# Altium schematic sheet AuxiliaryPowerSupply.SchDoc
size A4; SheetNumber: 13; SheetTotal: 15
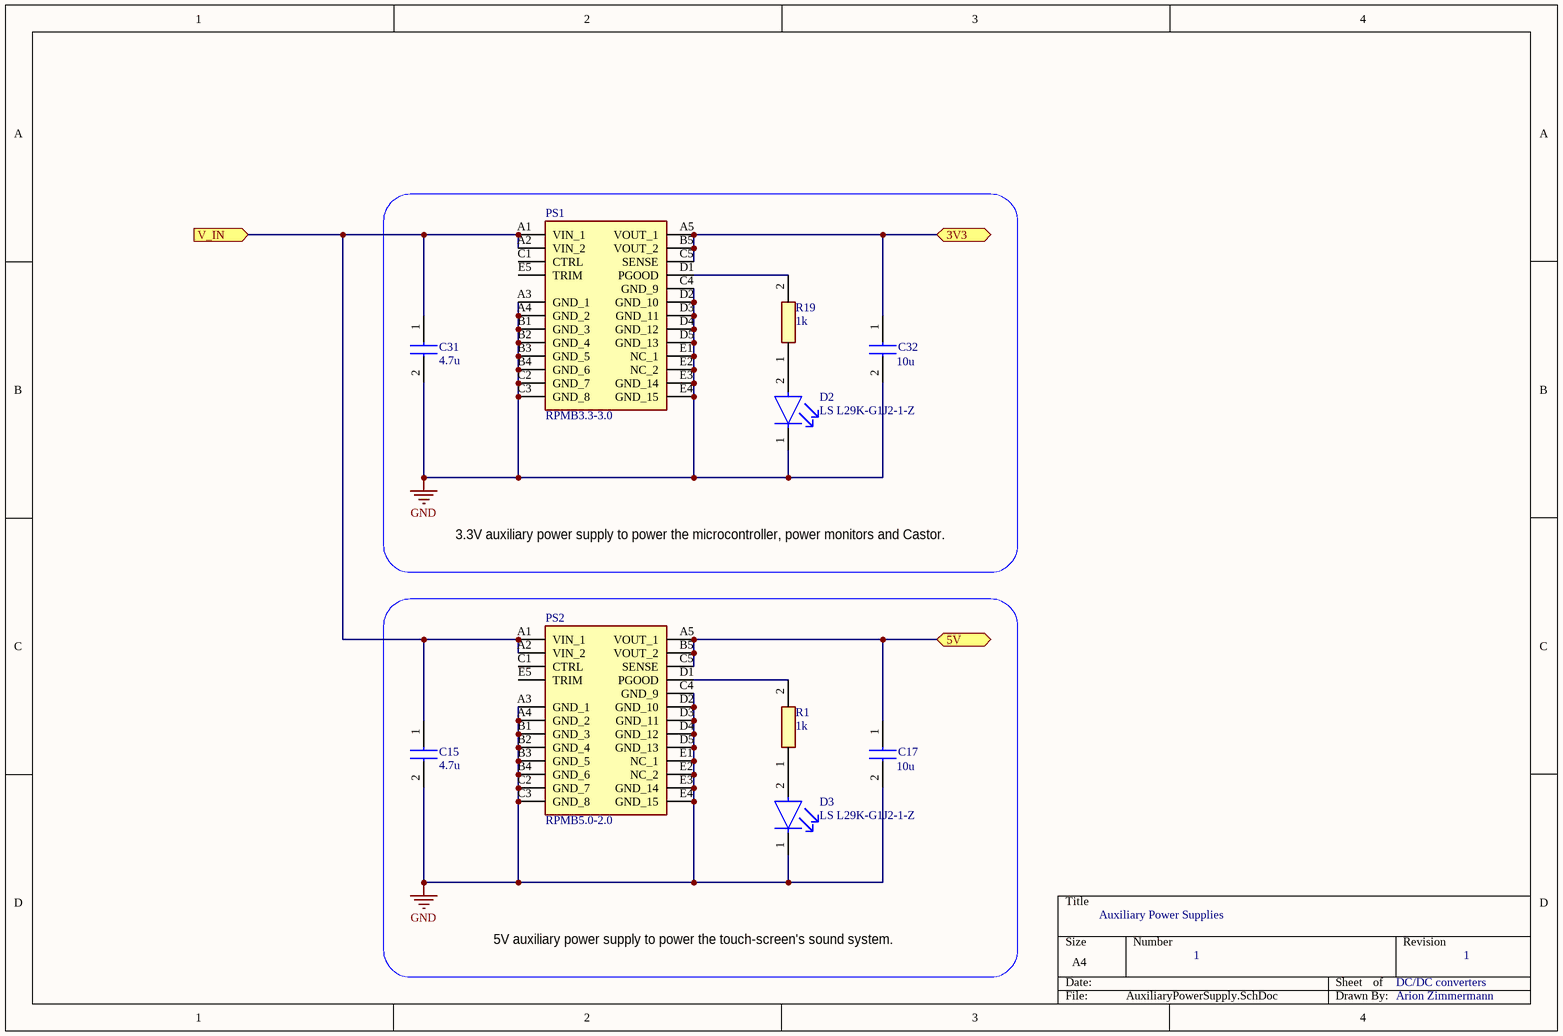
[diagram p0: AuxiliaryPowerSupply.SchDoc]

## Parts
C15  value 4.7u  [CAPC5750X310N]  (hidden comment: C5750JB2A475M230KA)
C17  value 10u  [C1206]  (hidden comment: C1206C106K4RACTU)
C31  value 4.7u  [CAPC5750X310N]  (hidden comment: C5750JB2A475M230KA)
C32  value 10u  [C1206]  (hidden comment: C1206C106K4RACTU)
D2  LS L29K-G1J2-1-Z  [FP-LS_L29K-MFG]
D3  LS L29K-G1J2-1-Z  [FP-LS_L29K-MFG]
PS1  RPMB3.3-3.0  [RPMB5030]
PS2  RPMB5.0-2.0  [RPMB5020]
R1  value 1k  [RESC1608X55N]  (hidden comment: CRCW06031K00JNEAC)
R19  value 1k  [RESC1608X55N]  (hidden comment: CRCW06031K00JNEAC)

## Ports
3V3 (bidir), 5V (bidir), V_IN (in)

## Nets
GND: C15.2 C17.2 C31.2 C32.2 D2.1(C) D3.1(C) PS1.A3(GND_1) PS1.A4(GND_2) PS1.B1(GND_3) PS1.B2(GND_4) PS1.B3(GND_5) PS1.B4(GND_6) PS1.C2(GND_7) PS1.C3(GND_8) PS1.C4(GND_9) PS1.D2(GND_10) PS1.D3(GND_11) PS1.D4(GND_12) PS1.D5(GND_13) PS1.E1(NC_1) PS1.E2(NC_2) PS1.E3(GND_14) PS1.E4(GND_15) PS2.A3(GND_1) PS2.A4(GND_2) PS2.B1(GND_3) PS2.B2(GND_4) PS2.B3(GND_5) PS2.B4(GND_6) PS2.C2(GND_7) PS2.C3(GND_8) PS2.C4(GND_9) PS2.D2(GND_10) PS2.D3(GND_11) PS2.D4(GND_12) PS2.D5(GND_13) PS2.E1(NC_1) PS2.E2(NC_2) PS2.E3(GND_14) PS2.E4(GND_15)
3V3: C32.1 PS1.A5(VOUT_1) PS1.B5(VOUT_2) PS1.C5(SENSE) ; port 3V3
5V: C17.1 PS2.A5(VOUT_1) PS2.B5(VOUT_2) PS2.C5(SENSE) ; port 5V
V_IN: C15.1 C31.1 PS1.A1(VIN_1) PS1.A2(VIN_2) PS2.A1(VIN_1) PS2.A2(VIN_2) ; port V_IN
NetD2_2: D2.2(A) R19.1
NetD3_2: D3.2(A) R1.1
NetPS1_D1: PS1.D1(PGOOD) R19.2
NetPS2_D1: PS2.D1(PGOOD) R1.2

Not connected (* = marked no-connect by the designer): PS1 C1(CTRL) E5(TRIM); PS2 C1(CTRL) E5(TRIM)

## Notes on the sheet
- 3.3V auxiliary power supply to power the microcontroller, power monitors and Castor.
- Auxiliary Power Supplies
- 5V auxiliary power supply to power the touch-screen's sound system.
- 1
- DC/DC converters
- Arion Zimmermann

## Library data of the parts
C15 C31 = C5750X7R2A475K230KA: Capacitor; Manufacturer_Name: TDK; Datasheet Link: https://product.tdk.com/de/search/capacitor/ceramic/mlcc/info?part_no=C5750X7R2A475K230KA; Height: 3.1mm; Manufacturer_Part_Number: C5750X7R2A475K230KA; Mouser Part Number: 810-C5750X7R2A475K; Mouser Price/Stock: https://www.mouser.co.uk/ProductDetail/TDK/C5750X7R2A475K230KA?qs=NRhsANhppD88FUXESCqIJQ%3D%3D; Arrow Part Number: C5750X7R2A475K230KA; Arrow Price/Stock: https://www.arrow.com/en/products/c5750x7r2a475k230ka/tdk; Supplier 1: Mouser; Supplier Part Number 1: 810-C5750JB2A475M23A
C17 C32 = C1206C106K4RACTU: Capacitor; Manufacturer_Name: Kemet; Datasheet Link: https://content.kemet.com/datasheets/KEM_C1002_X7R_SMD.pdf; Manufacturer_Part_Number: C1206C106K4RACTU; Mouser Part Number: 80-C1206C106K4R; Mouser Price/Stock: https://www.mouser.co.uk/ProductDetail/KEMET/C1206C106K4RACTU?qs=guDyKOyRtV0mxqxQedB7kA%3D%3D; Arrow Part Number: C1206C106K4RACTU; Arrow Price/Stock: https://www.arrow.com/en/products/c1206c106k4ractu/kemet-corporation
D2 D3 = CMP-62016-000014-1: LED RED DIFFUSED 0603 SMD; Manufacturer: Osram Opto; Luminous Flux: 0.0081/0.0254lm; Forward Voltage: 1.8V; Luminous Intensity: 1.8-2.24/5.6-7.1mcd; Reverse Voltage: 12V; Peak Emmision Wavelength: 643nm; Max Junction Temp: +110°C; Viewing Angle: 160°; Wavelength: 630nm; Forward Current: 2mA; Led Orientation: Top View; Category: Diode; Temperature Range High: +100°C; Automotive: No; Temperature: -40°C to +100°C; Device Class L3: unset; Mouser Description: LED Uni-Color Red 643nm Automotive 2-Pin SMD T/R; Manufacturer Part Number: LS L29K-G1J2-1-Z; ComponentLink2Description: Datasheet; Lead Free: Yes; Device Class L2: LEDs; ComponentLink2URL: https://dammedia.osram.info/media/resource/hires/osram-dam-5662679/LS%20L29K_EN.pdf; Temperature Range Low: -40°C; RoHS: TRUE; Digikey Description: LED RED DIFFUSED 0603 SMD; Colour: Red; Device Class L1: Optoelectronics; Package: LS_L29K; Octopart: https://octopart.com/ls+l29k-g1j2-1-z-osram+opto-31093939; Height: 0.67mm
PS1 = RPMB5.0-3.0: Power Supply; Manufacturer_Name: RECOM Power; Datasheet Link: https://componentsearchengine.com/Datasheets/1/RPMB5.0-3.0.pdf; Height: 3.75mm; Manufacturer_Part_Number: RPMB5.0-3.0; Mouser Part Number: 919-RPMB5.0-3.0; Mouser Price/Stock: https://www.mouser.co.uk/ProductDetail/RECOM-Power/RPMB50-30?qs=wnTfsH77Xs7FdqATAuFwWQ%3D%3D; Supplier 1: Mouser; Supplier Part Number 1: 919-RPMB3.3-3.0
PS2 = RPMB5.0-2.0: Power Supply; Manufacturer_Name: RECOM Power; Datasheet Link: https://g.recomcdn.com/media/Datasheet/pdf/.f_GMSoRX/.t173c310db6f6fe5108a0/Datasheet-322/RPMB-2_0.pdf; Height: 4mm; Manufacturer_Part_Number: RPMB5.0-2.0
R1 R19 = CRCW06031K00JNEAC: Resistor; Manufacturer_Name: Vishay; Datasheet Link: http://www.vishay.com/docs/28773/crcwce3.pdf; Height: 0.55mm; Manufacturer_Part_Number: CRCW06031K00JNEAC; Mouser Part Number: 71-CRCW06031K00JNEAC; Mouser Price/Stock: https://www.mouser.co.uk/ProductDetail/Vishay-Dale/CRCW06031K00JNEAC?qs=E3Y5ESvWgWPM5t3DlmyFHQ%3D%3D; Arrow Part Number: CRCW06031K00JNEAC; Arrow Price/Stock: https://www.arrow.com/en/products/crcw06031k00jneac/vishay?region=nac